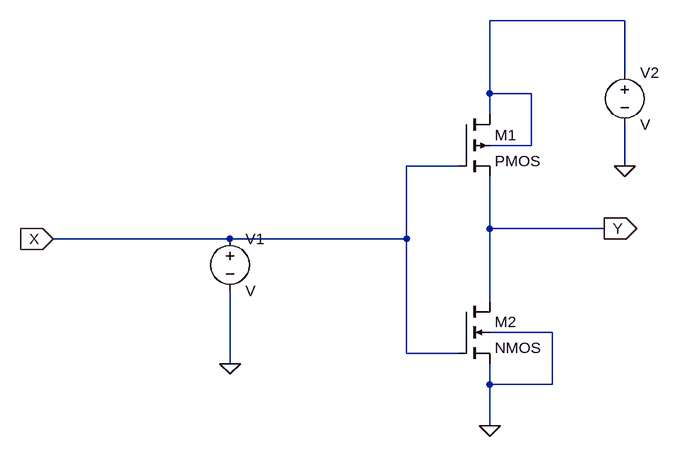
[diagram p0: schematic Draft2.asc]
Draft2.asc, the LTspice schematic file:
Version 4
SHEET 1 880 680
WIRE 672 -192 464 -192
WIRE 672 -112 672 -192
WIRE 464 -80 464 -192
WIRE 528 -80 464 -80
WIRE 464 -48 464 -80
WIRE 528 0 528 -80
WIRE 528 0 464 0
WIRE 416 32 336 32
WIRE 672 32 672 -32
WIRE 464 128 464 48
WIRE 640 128 464 128
WIRE 64 144 -208 144
WIRE 336 144 336 32
WIRE 336 144 64 144
WIRE 464 240 464 128
WIRE 560 288 464 288
WIRE 336 320 336 144
WIRE 416 320 336 320
WIRE 64 336 64 224
WIRE 464 368 464 336
WIRE 560 368 560 288
WIRE 560 368 464 368
WIRE 464 432 464 368
FLAG 64 336 0
FLAG 464 432 0
FLAG 672 32 0
FLAG 640 128 Y
IOPIN 640 128 Out
FLAG -208 144 X
IOPIN -208 144 In
SYMBOL voltage 64 128 R0
SYMATTR InstName V1
SYMBOL voltage 672 -128 R0
SYMATTR InstName V2
SYMBOL pmos4 416 -48 R0
SYMATTR InstName M1
SYMBOL nmos4 416 240 R0
SYMATTR InstName M2

The netlist it stands for:
* Draft2.asc
V1 X 0 V
V2 N001 0 V
M1 N001 X Y N001 PMOS
M2 Y X 0 0 NMOS
.model NMOS NMOS
.model PMOS PMOS
.lib standard.mos
.backanno
.end